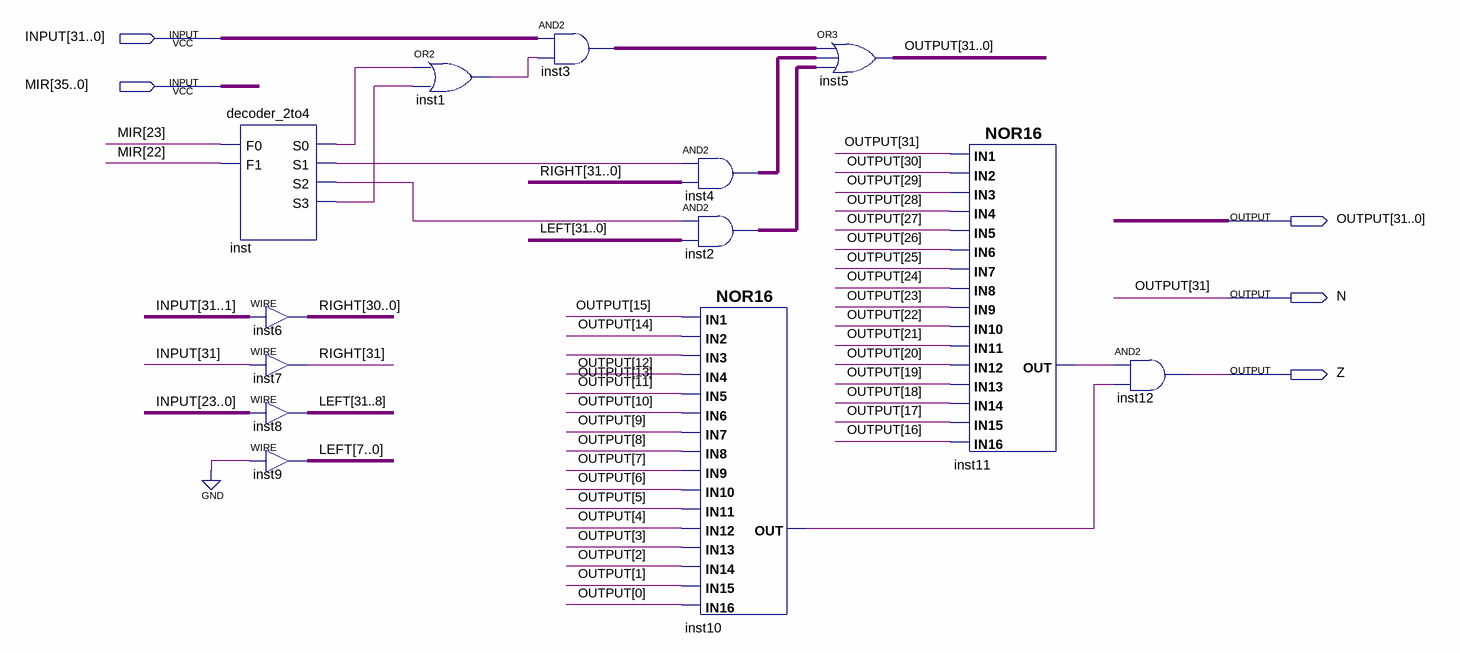
[diagram p0: schematic sheet]
// Quartus schematic shifter.bdf as structural Verilog: 13 symbols, 5 pins
module shifter (
  input  [31:0] INPUT,
  input  [35:0] MIR,
  output [31:0] OUTPUT,
  output N,
  output Z
);

  wire inst1_out, inst10_out, inst11_out, inst_s0, inst_s1, inst_s2, inst_s3;
  wire [31:0] inst2_out, inst3_out, inst4_out, LEFT, RIGHT;

  decoder_2to4 inst (.F0(MIR[23]), .F1(MIR[22]), .S3(inst_s3), .S2(inst_s2), .S1(inst_s1), .S0(inst_s0));
  assign RIGHT[30:0] = INPUT[31:1];  // WIRE inst6
  assign RIGHT[31] = INPUT[31];  // WIRE inst7
  assign LEFT[31:8] = INPUT[23:0];  // WIRE inst8
  assign LEFT[7:0] = {8{1'b0}};  // WIRE inst9
  or inst1 (inst1_out, inst_s0, inst_s3);
  assign inst3_out = INPUT & {32{inst1_out}};  // AND2 inst3, 32 bits wide
  assign inst4_out = {32{inst_s1}} & RIGHT;  // AND2 inst4, 32 bits wide
  assign inst2_out = {32{inst_s2}} & LEFT;  // AND2 inst2, 32 bits wide
  nor inst10 (inst10_out, OUTPUT[15], OUTPUT[14], OUTPUT[13], OUTPUT[12], OUTPUT[11], OUTPUT[10], OUTPUT[9], OUTPUT[8], OUTPUT[7], OUTPUT[6], OUTPUT[5], OUTPUT[4], OUTPUT[3], OUTPUT[2], OUTPUT[1], OUTPUT[0]);
  assign {N, OUTPUT[30:0]} = inst3_out | inst4_out | inst2_out;  // OR3 inst5, 32 bits wide
  nor inst11 (inst11_out, N, OUTPUT[30], OUTPUT[29], OUTPUT[28], OUTPUT[27], OUTPUT[26], OUTPUT[25], OUTPUT[24], OUTPUT[23], OUTPUT[22], OUTPUT[21], OUTPUT[20], OUTPUT[19], OUTPUT[18], OUTPUT[17], OUTPUT[16]);
  and inst12 (Z, inst11_out, inst10_out);

  assign OUTPUT[31] = N;
endmodule
